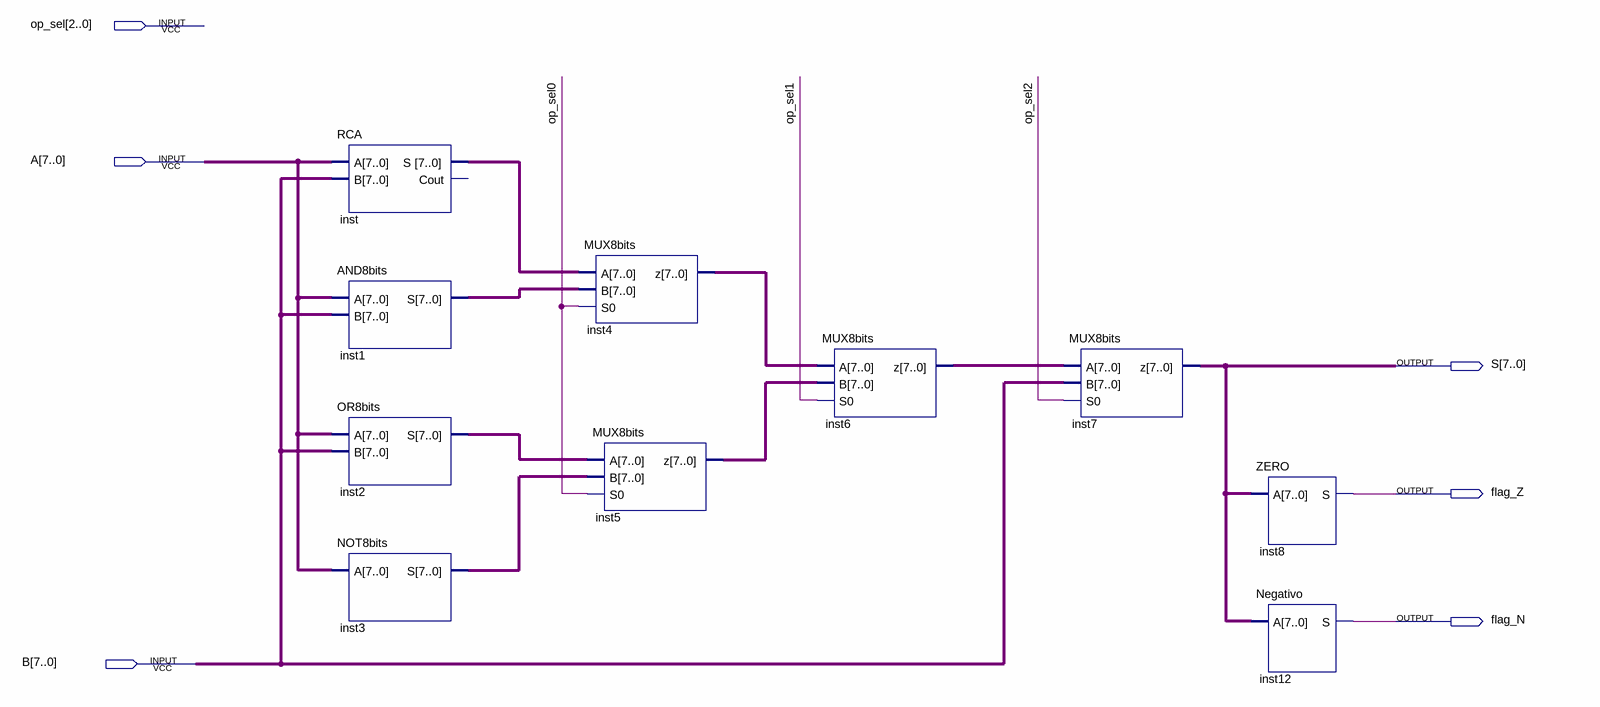
[diagram p0: schematic sheet]
// Quartus schematic ULA.bdf as structural Verilog: 10 symbols, 6 pins
module ULA (
  input  [2:0] op_sel,
  input  [7:0] A,
  input  [7:0] B,
  output [7:0] S,
  output flag_Z,
  output flag_N
);

  wire [7:0] inst1_s, inst2_s, inst3_s, inst4_z, inst5_z, inst6_z, inst_s;

  RCA inst (.A(A), .B(B), .S(inst_s));  // open: Cout
  AND8bits inst1 (.A(A), .B(B), .S(inst1_s));
  OR8bits inst2 (.A(A), .B(B), .S(inst2_s));
  NOT8bits inst3 (.A(A), .S(inst3_s));
  MUX8bits inst4 (.A(inst_s), .B(inst1_s), .S0(op_sel[0]), .z(inst4_z));
  MUX8bits inst5 (.A(inst2_s), .B(inst3_s), .S0(op_sel[0]), .z(inst5_z));
  MUX8bits inst6 (.A(inst4_z), .B(inst5_z), .S0(op_sel[1]), .z(inst6_z));
  MUX8bits inst7 (.A(inst6_z), .B(B), .S0(op_sel[2]), .z(S));
  ZERO inst8 (.A(S), .S(flag_Z));
  Negativo inst12 (.A(S), .S(flag_N));
endmodule
